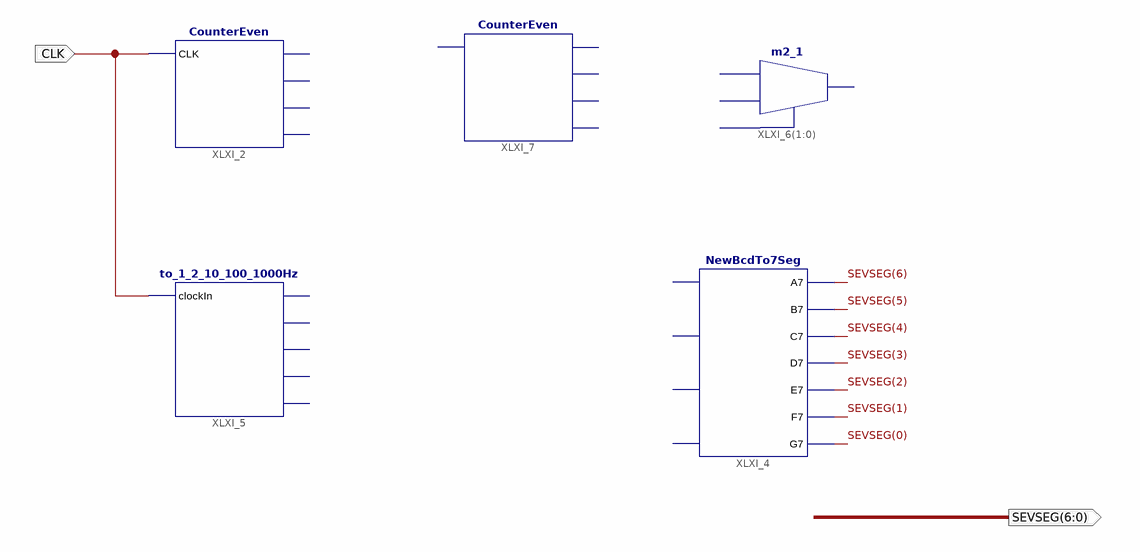
[diagram p0: schematic sheet 1]
// Xilinx ISE schematic CountEven.sch (spartan6) as structural Verilog: 5 symbols, 2 ports
module CountEven (
  input  CLK,
  output [6:0] SEVSEG
);

  CounterEven XLXI_2 (.CLK(CLK));  // open: C, B, A, D
  NewBcdTo7Seg XLXI_4 (
    .A7(SEVSEG[6]), .B7(SEVSEG[5]), .C7(SEVSEG[4]), .D7(SEVSEG[3]), .E7(SEVSEG[2]), .F7(SEVSEG[1]),
    .G7(SEVSEG[0]));  // open: D, C, B, A
  to_1_2_10_100_1000Hz XLXI_5 (.clockIn(CLK));  // open: to1hz, to2hz, to10hz, to100hz, to1000hz
  m2_1 XLXI_6[1:0] ();  // open: D0, D1, S0, O
  CounterEven XLXI_7 ();  // open: CLK, C, B, A, D
endmodule
